# EasyEDA Pro project power supply.epro

# Schematic Schematic1
Board Name: Board1; Create Date: 2026-01-18; Page Name: P1; Project Name: Power_Supply_Board; Schematic Name: Schematic1; Update Date: 2026-02-10; Company: EasyEDA.com; Page Size: A4; Version: V1.0
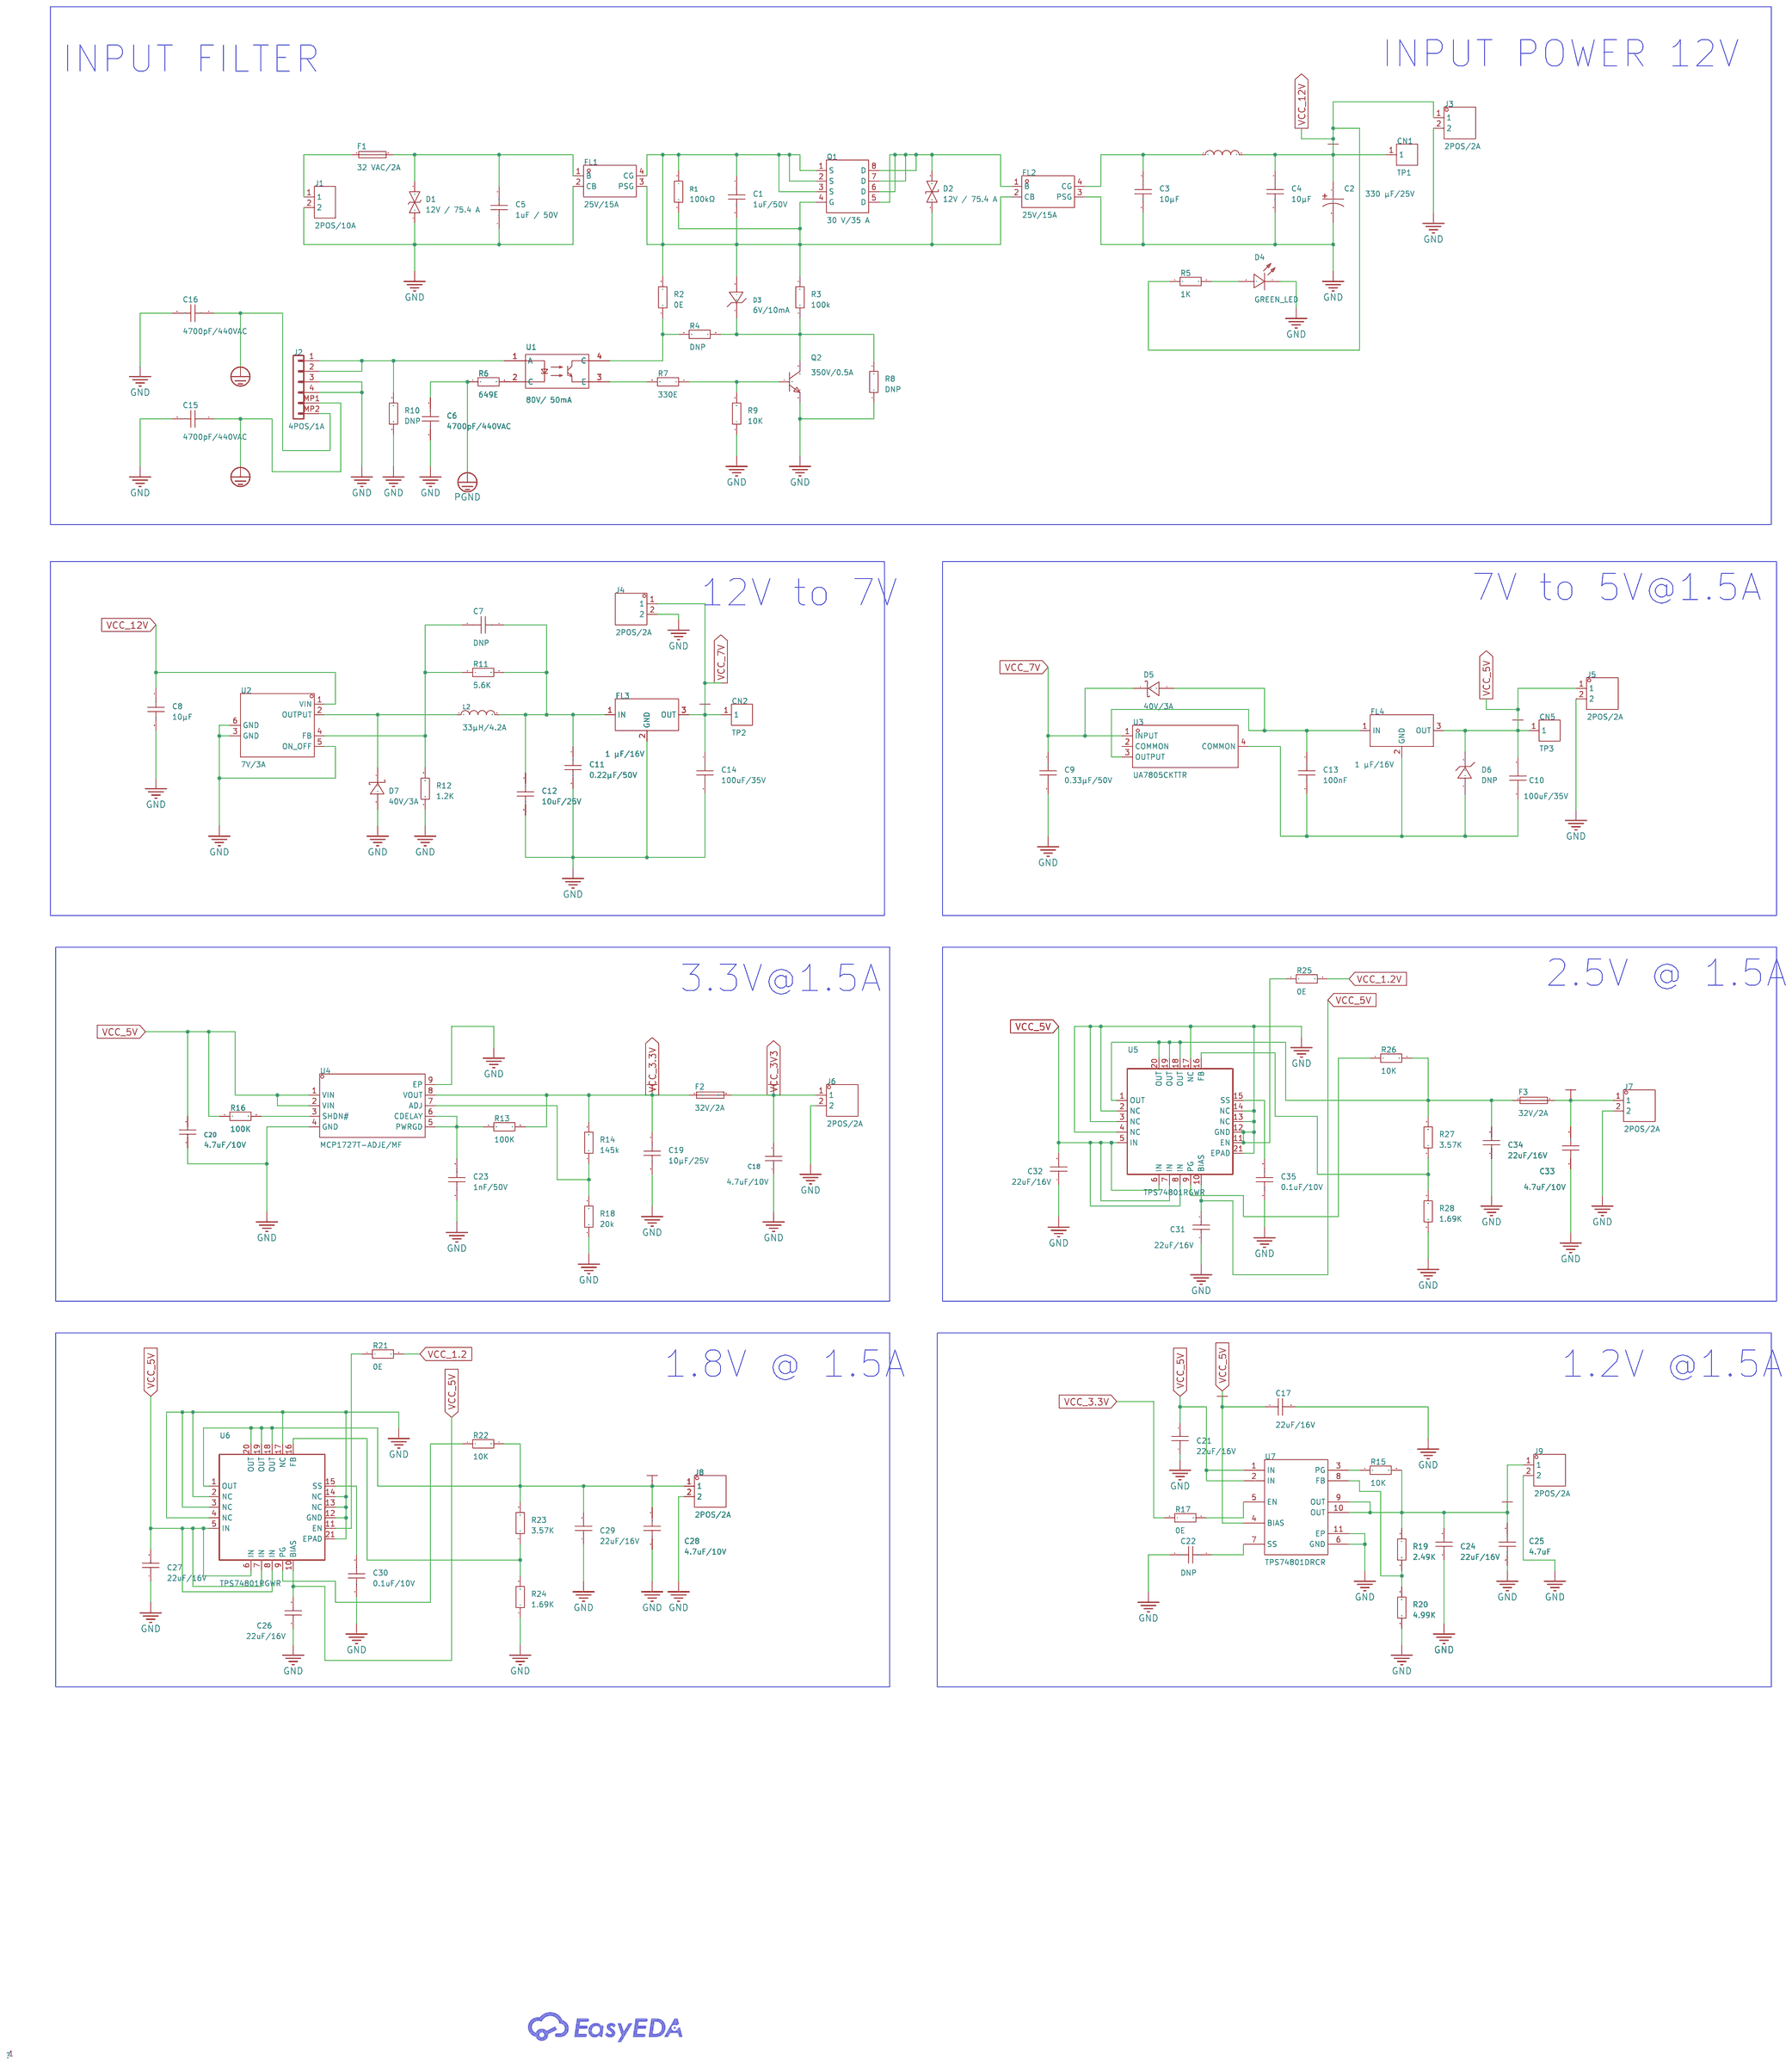
[diagram p0: schematic sheet]

## Parts
C1  1uF/50V  [C0603]
C2  330 µF/25V  [CAP-SMD_BD10.0-L10.3-W10.3-FD]
C3  10µF  [C0603]
C4  10µF  [C0603]
C5  1uF / 50V  [C0402]
C6  4700pF/440VAC  [CAP-TH_L11.0-W5.0-P10.00-D0.7]
C7  DNP  [C0603]
C8  10µF  [C0603]
C9  0.33µF/50V  [C0603]
C10  100uF/35V  [C0603]
C11  0.22µF/50V  [C0603]
C12  10uF/25V  [C0603]
C13  100nF  [C0603]
C14  100uF/35V  [C0603]
C15  4700pF/440VAC  [C0603]
C16  4700pF/440VAC  [C0603]
C17  22uF/16V  [C0805]
C18  4.7uF/10V  [C0603]
C19  10µF/25V  [C0603]
C20  4.7uF/10V  [C0603]
C21  22uF/16V  [C0805]
C22  DNP  [C0402]
C23  1nF/50V  [C0402]
C24  22uF/16V  [C0805]
C25  4.7uF  [C0603]
C26  22uF/16V  [C0805]
C27  22uF/16V  [C0805]
C28  4.7uF/10V  [C0603]
C29  22uF/16V  [C0805]
C30  0.1uF/10V  [C0402]
C31  22uF/16V  [C0805]
C32  22uF/16V  [C0805]
C33  4.7uF/10V  [C0603]
C34  22uF/16V  [C0805]
C35  0.1uF/10V  [C0402]
CN1  TP1  [CONN-SMD_5017]
CN2  TP2  [CONN-SMD_5017]
CN5  TP3  [CONN-SMD_5017]
D1  12V / 75.4 A  [D0402-BI]
D2  12V / 75.4 A  [SMC_L6.9-W5.9-LS7.9-BI]
D3  6V/10mA  [SOD-123_L2.7-W1.6-LS3.7-RD]
D4  GREEN_LED  [LED0603-RD]
D5  40V/3A  [SOD-128_L3.7-W2.5-LS4.7-RD]
D6  DNP  [SOD-123_L2.8-W1.8-LS3.7-RD]
D7  40V/3A  [SOD-128_L3.7-W2.5-LS4.7-RD]
F1  32 VAC/2A  [FUSE-SMD_L20.0-W5.2]
F2  32V/2A  [F0402]
F3  32V/2A  [F0402]
FL1  25V/15A  [FILTER-TH_6P-L12.0-W11.0_BNX016-01]
FL2  25V/15A  [FILTER-TH_6P-L12.0-W11.0_BNX016-01]
FL3  1 µF/16V  [FILTER-SMD_3P-L2.0-W1.2-L]
FL4  1 µF/16V  [FILTER-SMD_3P-L2.0-W1.2-L]
J1  2POS/10A  [CONN-TH_2P-P3.96-V]
J2  Molex_PicoBlade_1x4_0533980471  [antmicro-footprints:Conn_Molex_PicoBlade_1x4_0533980471]
J3  2POS/2A  [CONN-TH_S2B-PH-K-S-GW]
J4  2POS/2A  [CONN-TH_S2B-PH-K-S-GW]
J5  2POS/2A  [CONN-TH_S2B-PH-K-S-GW]
J6  2POS/2A  [CONN-TH_S2B-PH-K-S-GW]
J7  2POS/2A  [CONN-TH_S2B-PH-K-S-GW]
J8  2POS/2A  [CONN-TH_S2B-PH-K-S-GW]
J9  2POS/2A  [CONN-TH_S2B-PH-K-S-GW]
L1  22uH  [7447709220]
L2  33µH/4.2A  [IND-SMD_L12.0-W12.0-A]
Q1  30 V/35 A  [POWERPAK-1212-8_L3.0-W3.0-P0.65-LS3.3-BL]
Q2  350V/0.5A  [SOT-23-3_L2.9-W1.3-P1.90-LS2.4-BR]
R1  100kΩ  [R0603]
R2  0E  [R0603]
R3  100k  [R0603]
R4  DNP  [R0603]
R5  1K  [R0603]
R6  649E  [R0603]
R7  330E  [R0603]
R8  DNP  [R0603]
R9  10K  [R0603]
R10  DNP  [R0603]
R11  5.6K  [R0603]
R12  1.2K  [R0603]
R13  100K  [R0402]
R14  145k  [R0603]
R15  10K  [R0603]
R16  100K  [R0402]
R17  0E  [R0603]
R18  20k  [R0603]
R19  2.49K  [R0603]
R20  4.99K  [R0603]
R21  0E  [R0603]
R22  10K  [R0603]
R23  3.57K  [R0603]
R24  1.69K  [R0603]
R25  0E  [R0603]
R26  10K  [R0603]
R27  3.57K  [R0603]
R28  1.69K  [R0603]
U1  80V/ 50mA  [SOP-4_L6.5-W4.6-P2.54-LS10.3-TL]
U2  7V/3A  [TO-263-5_L10.4-W8.6-P1.70-LS15.3-BR]
U3  UA7805CKTTR  [TO-263-3_L10.2-W9.0-P2.54-LS15.2-TL]
U4  MCP1727T-ADJE/MF  [DFN-8_L3.0-W3.0-P0.65-BL-EP]
U5  TPS74801RGWR  [VQFN-20_L5.0-W5.0-P0.65-TL-EP]
U6  TPS74801RGWR  [VQFN-20_L5.0-W5.0-P0.65-TL-EP]
U7  TPS74801DRCR  [VSON-10_L3.0-W3.0-P0.50-TL-EP]

## Library data of the parts
C1 C3 C4 C7-C16 C19 C25 C28 C33 = CAP_0603: Supplier Footprint: 0603
C2 = EEHZA1E331P: Capacitance:330uF Tolerance:±20% Tolerance:±20% Voltage Rating:25V Ripple Current:375mA@100Hz Equivalent Series Resistance(ESR):20mΩ Lifetime:10000hrs@105℃ Operating Temperature:-55℃~+105℃ Operating Temperature:-55℃~+105℃ Pin Spacing:- Diameter:10mm Heigh; LCSC Part Name: 330uF ±20% 25V; Supplier Part: C236302; Manufacturer: PANASONIC(松下); Supplier Footprint: SMD,D10xL10.2mm; JLCPCB Part Class: Extended Part; Datasheet: https://item.szlcsc.com/datasheet/EEHZA1E331P/235924.html; Supplier: LCSC; Tolerance: ±20%; Voltage Rating: 25V; Ripple Current: 375mA@100Hz; Equivalent Series Resistance(ESR): 20mΩ; Lifetime: 10000hrs@105℃; Operating Temperature: -55℃~+105℃; Diameter: 10mm; Height - Seated (Max): 10.2mm
C5 = CL05B104KO5NNNC: Capacitance:100nF Tolerance:±10% Tolerance:±10% Voltage Rating:16V Temperature Coefficient:X7R; LCSC Part Name: 100nF ±10% 16V; Supplier Part: C1525; Manufacturer: SAMSUNG(三星); Supplier Footprint: 0402; JLCPCB Part Class: Basic Part; Datasheet: https://item.szlcsc.com/datasheet/CL05B104KO5NNNC/1877.html; Supplier: LCSC; Tolerance: ±10%; Voltage Rating: 16V; Temperature Coefficient: X7R
C6 = C947U472MZVDBA7317: Capacitance:4.7nF Tolerance:±20% Tolerance:±20% Voltage(AC):440V Ratings:X1,Y2 Operating Temperature:-40℃~+125℃ Operating Temperature:-40℃~+125℃; LCSC Part Name: 等级:X1,Y2 4.7nF ±20% 440V; Supplier Part: C1623429; Manufacturer: KEMET(基美); Supplier Footprint: 插件,P=7.5mm; JLCPCB Part Class: Extended Part; Datasheet: https://item.szlcsc.com/datasheet/C947U472MZVDBA7317/1714275.html; Supplier: LCSC; Tolerance: ±20%; Voltage(AC): 440V; Ratings: X1,Y2; Operating Temperature: -40℃~+125℃
C17 C21 C24 C26 C27 C29 C31 C32 C34 = CL21A226MOQNNNE: 容值:22uF;精度:±20%;额定电压:16V;材质(温度系数):X5R;; LCSC Part Name: 22uF ±20% 16V; Supplier Part: C98190; Manufacturer: SAMSUNG(三星); Supplier Footprint: 0805; JLCPCB Part Class: Extended Part; Datasheet: https://atta.szlcsc.com/upload/public/pdf/source/20170412/1491969143888.pdf; Supplier: LCSC; Tolerance: ±20%; Voltage Rated: 16V; Temperature Coefficient: X5R
C18 C20 = CL10A475KP8NNNC: Capacitance:4.7uF Tolerance:±10% Tolerance:±10% Voltage Rating:10V Temperature Coefficient:X5R; LCSC Part Name: 4.7uF ±10% 10V; Supplier Part: C1705; Manufacturer: SAMSUNG(三星); Supplier Footprint: 0603; JLCPCB Part Class: Extended Part; Datasheet: https://item.szlcsc.com/datasheet/CL10A475KP8NNNC/2057.html; Supplier: LCSC; Tolerance: ±10%; Voltage Rating: 10V; Temperature Coefficient: X5R
C22 C30 C35 = CC0402JRX7R6BB104: Capacitance: Tolerance:±5% Tolerance:±5% Voltage Rated: Temperature Coefficient:; LCSC Part Name: 100nF ±5% 10V; Supplier Part: C527001; Manufacturer: YAGEO(国巨); Supplier Footprint: 0402; JLCPCB Part Class: Extended Part; Datasheet: https://atta.szlcsc.com/upload/public/pdf/source/20200508/C527001_BBD65F146D934E2FFF77EAA00FC82E63.pdf; Supplier: LCSC; Tolerance: ±5%
C23 = GRM1555C1H102JA01D: Capacitance:1nF Tolerance:±5% Tolerance:±5% Voltage Rating:50V Temperature Coefficient:C0G; LCSC Part Name: 1nF ±5% 50V; Supplier Part: C76947; Manufacturer: muRata(村田); Supplier Footprint: 0402; JLCPCB Part Class: Extended Part; Datasheet: https://item.szlcsc.com/datasheet/GRM1555C1H102JA01D/78074.html; Supplier: LCSC; Tolerance: ±5%; Voltage Rating: 50V; Temperature Coefficient: C0G
CN1 CN2 CN5 = 5017: Supplier Part: C9900015874; Supplier Footprint: Testpoint_SMD; JLCPCB Part Class: Extended Part; Supplier: LCSC
D1 = GSEPD15B0005: Supplier Part: C19841114; Manufacturer: GOOD-ARK(固锝); Supplier Footprint: 0402; JLCPCB Part Class: Extended Part; Datasheet: https://atta.szlcsc.com/upload/public/pdf/source/20240122/F55FF7028080527729AF26468FA4F1C4.pdf; Supplier: LCSC
D2 = SMCJ12CA_C41411748: Polarity:Bidirectional Reverse Stand-Off Voltage (Vrwm):12V Clamping Voltage:19.9V Peak Pulse Current (Ipp):75.4A Peak Pulse Power Dissipation (Ppp):1.5kW Voltage - Breakdown:14.7V Reverse Leakage Current (Ir):1uA Number of Channels:2 Operating Temperatur; LCSC Part Name: 双向TVS 12V截止 峰值浪涌电流：75.4A; Supplier Part: C41411748; Manufacturer: R+O(宏嘉诚); Supplier Footprint: SMC(DO-214AB); JLCPCB Part Class: Extended Part; Datasheet: https://item.szlcsc.com/datasheet/SMCJ12CA/43223691.html; Supplier: LCSC; Polarity: Bidirectional; Reverse Stand-Off Voltage (Vrwm): 12V; Clamping Voltage: 19.9V; Peak Pulse Current (Ipp): 75.4A; Peak Pulse Power Dissipation (Ppp): 1.5kW; Voltage - Breakdown: 14.7V; Reverse Leakage Current (Ir): 1uA; Number of Channels: 2; Operating Temperature: -55℃~+150℃; level of protection: IEC 61000-4-2; Type: TVS
D3 = MMSZ5233BT1G: Diode Configuration:Independent Zener Voltage(Nom):6V Reverse Leakage Current (Ir):5uA@3.5V Zener Voltage(Range):5.7V~6.3V Zener Voltage(Range):5.7V~6.3V Pd - Power Dissipation:500mW Impedance(Zzt):7Ω Impedance(Zzk):1.6kΩ Operating Junction Temperature Ra; Supplier Part: C145506; Manufacturer: onsemi(安森美); Supplier Footprint: SOD-123; JLCPCB Part Class: Extended Part; Datasheet: https://item.szlcsc.com/datasheet/MMSZ5233BT1G/156838.html; Supplier: LCSC; Diode Configuration: Independent; Zener Voltage(Nom): 6V; Reverse Leakage Current (Ir): 5uA@3.5V; Zener Voltage(Range): 5.7V~6.3V; Pd - Power Dissipation: 500mW; Impedance(Zzt): 7Ω; Impedance(Zzk): 1.6kΩ; Operating Junction Temperature Range: -55℃~+150℃
D4 = LTST-C190KGKT: Emitted Color:Green-yellow Forward Voltage (VF):2V Forward Voltage (VF):2V Power Dissipation:75mW Forward Current:20mA Dominant Wavelength:567.5nm~576.5nm Dominant Wavelength:567.5nm~576.5nm Peak Wavelength:574nm Diode Configuration:- Lens Color:无色透明透镜 Co; LCSC Part Name: 普绿/黄绿; Supplier Part: C125094; Manufacturer: LITEON(光宝); Supplier Footprint: 0603; JLCPCB Part Class: Extended Part; Datasheet: https://atta.szlcsc.com/upload/public/pdf/source/20180129/C125094_15171883203831315957.pdf; Supplier: LCSC; Emitted Color: Green-yellow; Forward Voltage (VF): 2V; Power Dissipation: 75mW; Forward Current: 20mA; Dominant Wavelength: 567.5nm~576.5nm; Peak Wavelength: 574nm; Lens Color: 无色透明透镜; Luminous Intensity: 35mcd; Viewing Angle: 130°; Operating Temperature: -30℃~+85℃
D5 D7 = PMEG40T30EPX: Voltage - Forward(Vf@If):525mV@3A Voltage - DC Reverse(Vr):40V Current - Rectified:3A Reverse Leakage Current (Ir):28uA@40V; LCSC Part Name: 电压:40V 电流:3A; Supplier Part: C552919; Manufacturer: Nexperia(安世); Supplier Footprint: SOD-128; JLCPCB Part Class: Extended Part; Datasheet: https://item.szlcsc.com/datasheet/PMEG40T30EPX/573916.html; Supplier: LCSC; Voltage - Forward(Vf@If): 525mV@3A; Voltage - DC Reverse(Vr): 40V; Current - Rectified: 3A; Reverse Leakage Current (Ir): 28uA@40V
D6 = MMSZ5231B-7-F: Diode Configuration:Independent Zener Voltage(Nom):5.1V Reverse Leakage Current (Ir):5uA@2.0V Zener Voltage(Range):4.85V~5.36V Zener Voltage(Range):4.85V~5.36V Pd - Power Dissipation:370mW Impedance(Zzt):17Ω Impedance(Zzk):1.6kΩ Operating Junction Tempera; LCSC Part Name: 独立式 耐压:5.1V 电流:5uA@2.0V; Supplier Part: C85181; Manufacturer: DIODES(美台); Supplier Footprint: SOD-123; JLCPCB Part Class: Extended Part; Datasheet: https://item.szlcsc.com/datasheet/MMSZ5231B-7-F/86353.html; Supplier: LCSC; Diode Configuration: Independent; Zener Voltage(Nom): 5.1V; Reverse Leakage Current (Ir): 5uA@2.0V; Zener Voltage(Range): 4.85V~5.36V; Pd - Power Dissipation: 370mW; Impedance(Zzt): 17Ω; Impedance(Zzk): 1.6kΩ; Operating Junction Temperature Range: -65℃~+150℃
F1 = Fuse SGT520-8A: Type:Glass Tube Fuse Current Rating:8A Voltage Rating (AC):250V Voltage Rating (DC):250V Operating Temperature:-55℃~+125℃ Operating Temperature:-55℃~+125℃ Melting I2t:166 Interrupt Rating:8A@250VAC Diameter (φD):5.2mm Length:20mm; LCSC Part Name: 8A 250VAC 慢断; Supplier Part: C2997196; Manufacturer: SET(赛尔特); Supplier Footprint: D5.2xL20mm; JLCPCB Part Class: Extended Part; Datasheet: https://item.szlcsc.com/datasheet/Fuse%2520SGT520-8A/3466294.html; Supplier: LCSC; Type: Glass Tube Fuse; Current Rating: 8A; Voltage Rating (AC): 250V; Voltage Rating (DC): 250V; Operating Temperature: -55℃~+125℃; Melting I2t: 166; Interrupt Rating: 8A@250VAC; Diameter (φD): 5.2mm; Length: 20mm
F2 F3 = ERBRD2R00X: Type:Surface Mount Fuse Current Rating:2A Voltage Rating (DC):32V Operating Temperature:-40℃~+125℃ Operating Temperature:-40℃~+125℃ Interrupt Rating:35A Length:1mm Width:0.5mm Height:0.39mm; LCSC Part Name: 贴片式保险丝; Supplier Part: C424348; Manufacturer: PANASONIC(松下); Supplier Footprint: 0402; JLCPCB Part Class: Extended Part; Datasheet: https://item.szlcsc.com/datasheet/ERBRD2R00X/417761.html; Supplier: LCSC; Type: Surface Mount Fuse; Current Rating: 2A; Voltage Rating (DC): 32V; Operating Temperature: -40℃~+125℃; Interrupt Rating: 35A; Length: 1mm; Width: 0.5mm; Height: 0.39mm
FL1 FL2 = BNX016-01: Voltage Rating:25V Current Rating:15A Frequency - Cutoff or Center:- Frequency - Cutoff or Center:- Inductance:- Filter Order:5 Resistance:- Capacitance:- ESD Protection:Yes Number of Channels:2 Attenuation Value:40dB@100kHz~1GHz Operating Temperature:-40; LCSC Part Name: 两路5阶 具有ESD保护的EMI滤波器; Supplier Part: C393167; Manufacturer: muRata(村田); Supplier Footprint: 插件; JLCPCB Part Class: Extended Part; Datasheet: https://item.szlcsc.com/datasheet/BNX016-01/370693.html; Supplier: LCSC; Voltage Rating: 25V; Current Rating: 15A; Filter Order: 5; ESD Protection: Yes; Number of Channels: 2; Attenuation Value: 40dB@100kHz~1GHz; Operating Temperature: -40℃~+125℃
FL3 FL4 = NFM21PC105B1C3D: Nominal Capacitance:1uF Tolerance:±20% Tolerance:±20% Voltage Rating:16V Current Rating:4A DC Resistance(DCR):20mΩ Operating Temperature:-40℃~+85℃ Operating Temperature:-40℃~+85℃; LCSC Part Name: 1.0uF(105) ±20%16V; Supplier Part: C92518; Manufacturer: muRata(村田); Supplier Footprint: SMD-4P,2x1.2mm; JLCPCB Part Class: Extended Part; Datasheet: https://item.szlcsc.com/datasheet/NFM21PC105B1C3D/93711.html; Supplier: LCSC; Nominal Capacitance: 1uF; Tolerance: ±20%; Voltage Rating: 16V; Current Rating: 4A; DC Resistance(DCR): 20mΩ; Operating Temperature: -40℃~+85℃
J1 = B2P-VH-GZ: Pins Structure:1x2P Pitch:3.96mm Mounting Type:Through Hole Reference Series:VH Number of Pins:2P Number of Rows:1 Number of PINs Per Row:2 Row Spacing:- Current Rating:10A Contact Material:Brass Contact Plating:Gold Operating Temperature:-25℃~+85℃ Operat; LCSC Part Name: 1x2P 间距:3.96mm 直插 系列:VH; Supplier Part: C17525990; Manufacturer: JST; Supplier Footprint: 插件,P=3.96mm; JLCPCB Part Class: Extended Part; Datasheet: https://item.szlcsc.com/datasheet/B2P-VH-GZ/18655202.html; Supplier: LCSC; Pins Structure: 1x2P; Pitch: 3.96mm; Mounting Type: Through Hole; Reference Series: VH; Number of Pins: 2P; Number of Rows: 1; Number of PINs Per Row: 2; Current Rating: 10A; Contact Material: Brass; Contact Plating: Gold; Operating Temperature: -25℃~+85℃; Voltage Rating: 250V; Plastic Material: PA66; Flame Retardant Rating: UL94V-0; Color: White; Z-Height of the Board: 9.4mm; X-Length of Bottom Edge on Board (Spacing Line): 7.86mm; Y-Width of Bottom Edge on Board: 8.5mm
J2 = antmicroWire2BoardConnectors_Molex_PicoBlade_1x4_0533980471: Users: License: Apache-2.0; datasheet: https://www.molex.com/molex/products/part-detail/pcb_headers/0533980471; author: Antmicro; license: Apache-2.0; mpn: 0533980471; manufacturer: Molex; User doc link: https://www.molex.com/molex/products/part-detail/pcb_headers/0533980471
J3-J9 = S2B-PH-K-S-GW: Pins Structure:1x2P Pitch:2mm Mounting Type:Right Angle Reference Series:PH Number of Pins:2P Number of Rows:1 Number of PINs Per Row:2 Row Spacing:- Current Rating:2A Contact Material:Brass Contact Plating:Tin Operating Temperature:-25℃~+85℃ Operating Te; LCSC Part Name: 1x2P 间距:2mm 弯插 系列:PH; Supplier Part: C157932; Manufacturer: JST; Supplier Footprint: 弯插,P=2mm; JLCPCB Part Class: Extended Part; Datasheet: https://item.szlcsc.com/datasheet/S2B-PH-K-S-GW/169280.html; Supplier: LCSC; Pins Structure: 1x2P; Pitch: 2mm; Mounting Type: Right Angle; Reference Series: PH; Number of Pins: 2P; Number of Rows: 1; Number of PINs Per Row: 2; Current Rating: 2A; Contact Material: Brass; Contact Plating: Tin; Operating Temperature: -25℃~+85℃; Voltage Rating: 100V; Plastic Material: PA66; Flame Retardant Rating: UL94V-0; Supplementary Features: K Pin; Color: White; Z-Height of the Board: 4.8mm; X-Length of Bottom Edge on Board (Spacing Line): 5.9mm; Y-Width of Bottom Edge on Board: 7.6mm
L1 = 7447709220: Manufacturer Part: 22µH/5.3A; Manufacturer: WURTH
L2 = 7447709330: Inductance: Tolerance:±20% Tolerance:±20% Rated Current: Saturation Current (Isat):5.5A DC Resistance (DCR): Type:- Ratings:AEC-Q200; LCSC Part Name: 33uH ±20% 5.5A; Supplier Part: C2651182; Manufacturer: Wurth(伍尔特); Supplier Footprint: 1210; JLCPCB Part Class: Extended Part; Datasheet: https://atta.szlcsc.com/upload/public/pdf/source/20210414/76E7EC767D1F74C2F12BC88CD3718373.pdf; Supplier: LCSC; Tolerance: ±20%; Saturation Current (Isat): 5.5A; Ratings: AEC-Q200
Q1 = MSISH101DN-T1-GE3: Supplier Part: C51908760; Manufacturer: MSKSEMI(美森科); Supplier Footprint: DFN-8L(3x3); JLCPCB Part Class: Extended Part; Datasheet: https://item.szlcsc.com/datasheet/MSISH101DN-T1-GE3/54606248.html; Supplier: LCSC
Q2 = FMMT6517TA: type:NPN Current - Collector(Ic):500mA Collector - Emitter Voltage VCEO:350V Pd - Power Dissipation:350mW DC Current Gain:15@100mA,10V DC Current Gain:15@100mA,10V Transition frequency(fT):50MHz Current - Collector Cutoff:50nA Vce Saturation(VCE(sat)):1V@; LCSC Part Name: NPN 电流:500mA 电压:350V; Supplier Part: C155518; Manufacturer: DIODES(美台); Supplier Footprint: SOT-23; JLCPCB Part Class: Extended Part; Datasheet: https://item.szlcsc.com/datasheet/FMMT6517TA/166860.html; Supplier: LCSC; type: NPN; Current - Collector(Ic): 500mA; Collector - Emitter Voltage VCEO: 350V; Pd - Power Dissipation: 350mW; DC Current Gain: 15@100mA,10V; Transition frequency(fT): 50MHz; Current - Collector Cutoff: 50nA; Vce Saturation(VCE(sat)): 1V@50mA,5mA; Operating Temperature: -55℃~+150℃; Emitter-Base Voltage(Vebo): 7V
R1 = RC0603FR-07100KL: Type:Thick Film Resistors Resistance: Tolerance:±1% Tolerance:±1% Power(Watts): Overload Voltage (Max): Temperature Coefficient:±100ppm/℃ Temperature Coefficient:±100ppm/℃ Operating Temperature Range:-55℃~+155℃ Operating Temperature Range:-55℃~+155℃; LCSC Part Name: 厚膜电阻 100kΩ ±1% 100mW; Supplier Part: C14675; Manufacturer: YAGEO(国巨); Supplier Footprint: 0603; JLCPCB Part Class: Extended Part; Datasheet: https://atta.szlcsc.com/upload/public/pdf/source/20140324/1457707028752.pdf; Supplier: LCSC; Type: Thick Film Resistors; Tolerance: ±1%; Temperature Coefficient: ±100ppm/℃; Operating Temperature Range: -55℃~+155℃
R2-R12 R14 R15 R17-R28 = Res_0603: Supplier Footprint: 0603
R13 R16 = ERJ2RKF1003X: Type:Thick Film Resistors Resistance:100kΩ Tolerance:±1% Tolerance:±1% Power(Watts): Overload Voltage (Max):- Temperature Coefficient:±100ppm/℃ Temperature Coefficient:±100ppm/℃ Operating Temperature Range:-55℃~+155℃ Operating Temperature Range:-55℃~+155℃; LCSC Part Name: 100kΩ ±1% 100mW 厚膜电阻; Supplier Part: C192169; Manufacturer: PANASONIC(松下); Supplier Footprint: 0402; JLCPCB Part Class: Extended Part; Datasheet: https://atta.szlcsc.com/upload/public/pdf/source/20180621/C194072_A7E4037DF0016B74406F0B5B438DC1E1.pdf; Supplier: LCSC; Type: Thick Film Resistors; Tolerance: ±1%; Temperature Coefficient: ±100ppm/℃; Operating Temperature Range: -55℃~+155℃
U1 = VO617A-8X017T: Forward Voltage:1.35V Output Current:50mA Isolation Voltage(rms):5.3kV Number of Outputs:1 Rise time:2us Fall time:2us Operating Temperature:-55℃~+110℃ Operating Temperature:-55℃~+110℃; Supplier Part: C17653063; Manufacturer: VISHAY(威世); Supplier Footprint: SMD-4P; JLCPCB Part Class: Extended Part; Datasheet: https://atta.szlcsc.com/upload/public/pdf/source/231023/C17252083-247b27188f6e36515790b70740c37c97.pdf; Supplier: LCSC; Forward Voltage: 1.35V; Output Current: 50mA; Isolation Voltage(rms): 5.3kV; Number of Outputs: 1; Rise time: 2us; Fall time: 2us; Operating Temperature: -55℃~+110℃
U2 = LM2596S-ADJ_C3198435: Function:Step-down type Output Type:Adjustable Input Voltage:4.5V~40V Input Voltage:4.5V~40V Output Voltage:1.2V~37V Output Voltage:1.2V~37V Output Current:3A Switching Frequency:150kHz Switching Frequency:150kHz Operating Temperature:-40℃~+125℃@(TJ) Oper; LCSC Part Name: LM2596S-ADJ; Supplier Part: C3198435; Supplier Footprint: TO-263-5; Datasheet: https://atta.szlcsc.com/upload/public/pdf/source/20230921/2B96ED50C3BF1924A72365F91F431302.pdf; Supplier: LCSC; Function: Step-down type; Output Type: Adjustable; Input Voltage: 4.5V~40V; Output Voltage: 1.2V~37V; Output Current: 3A; Switching Frequency: 150kHz; Operating Temperature: -40℃~+125℃@(TJ); Synchronous Rectification: No; Number of Outputs: 1; Topology: Step-down; Switch tube (built-in/external): Built-in
U3 = UA7805CKTTR: Output Type:Fixed Voltage - Supply:25V Output Voltage:5V Output Voltage:5V Output Current:1.5A Power Supply Rejection Ratio (PSRR):78dB@(120Hz) Voltage Dropout:2V@(1A) standby current:4.2mA Noise:40uV Features:Short Circuit Protection；Over Temperature Pro; LCSC Part Name: 5V 1.5A 25V; Supplier Part: C962135; Manufacturer: TI(德州仪器); Supplier Footprint: TO-263-3; JLCPCB Part Class: Extended Part; Datasheet: https://www.ti.com/cn/lit/gpn/ua78; Supplier: LCSC; Output Type: Fixed; Voltage - Supply: 25V; Output Voltage: 5V; Output Current: 1.5A; Power Supply Rejection Ratio (PSRR): 78dB@(120Hz); Voltage Dropout: 2V@(1A); standby current: 4.2mA; Noise: 40uV; Features: Short Circuit Protection；Over Temperature Protection；Over Current Protection；Over Voltage Protection; Operating Temperature: 0℃~+125℃@(Ta); Output Configuration: Positive; Number of Outputs: 1
U4 = MCP1727T-ADJE/MF: Output Type:Adjustable Voltage - Supply:6V Output Voltage:800mV~5V Output Voltage:800mV~5V Output Current:1.5A Power Supply Rejection Ratio (PSRR):60dB@(100Hz) Voltage Dropout:330mV@(1.5A) standby current:120uA Noise:- Features:Enable；Under Voltage Lockou; LCSC Part Name: 800mV~5V 1.5A 6V; Supplier Part: C111281; Manufacturer: MICROCHIP(美国微芯); Supplier Footprint: DFN-8-EP(3x3); JLCPCB Part Class: Extended Part; Datasheet: https://item.szlcsc.com/datasheet/MCP1727T-ADJE%252FMF/112507.html; Supplier: LCSC; Output Type: Adjustable; Voltage - Supply: 6V; Output Voltage: 800mV~5V; Output Current: 1.5A; Power Supply Rejection Ratio (PSRR): 60dB@(100Hz); Voltage Dropout: 330mV@(1.5A); standby current: 120uA; Features: Enable；Under Voltage Lockout；Over Temperature Protection；Over Current Protection；Short Circuit Protection; Operating Temperature: -40℃~+125℃@(Tj); Output Configuration: Positive; Number of Outputs: 1
U5 U6 = TPS74801RGWR: Supplier: LCSC; Supplier Part: C129193; Manufacturer: Texas Instruments; JLCPCB Part Class: Extended Part
U7 = TPS74801DRCR: Output Type:Adjustable Voltage - Supply:5.5V Output Voltage:800mV~3.6V Output Voltage:800mV~3.6V Output Current:1.5A Power Supply Rejection Ratio (PSRR):60dB Voltage Dropout:60mV@(1.5A) standby current:- Noise:- Features:Enable；Over Temperature Protection; LCSC Part Name: 800mV~3.6V 1.5A 5.5V; Supplier Part: C105263; Manufacturer: TI(德州仪器); Supplier Footprint: VSON-10-EP(3x3); JLCPCB Part Class: Extended Part; Datasheet: https://www.ti.com/cn/lit/gpn/tps74801; Supplier: LCSC; Output Type: Adjustable; Voltage - Supply: 5.5V; Output Voltage: 800mV~3.6V; Output Current: 1.5A; Power Supply Rejection Ratio (PSRR): 60dB; Voltage Dropout: 60mV@(1.5A); Features: Enable；Over Temperature Protection；Over Current Protection；Under Voltage Lockout; Operating Temperature: -40℃~+125℃@(Tj); Output Configuration: Positive; Number of Outputs: 1

## Nets
GND: C2.2 C3.2 C4.2 C5.1 C6.1 C8.2 C9.2 C11.2 C12.2 C14.2 C15.2 C16.2 C17.2 C18.1 C19.2 C20.1 C21.1 C22.1 C23.1 C24.1 C25.2 C26.1 C27.1 C28.2 C29.1 C30.1 C31.1 C32.1 C33.2 C34.1 C35.1 D1.1 D4.1(-) D7.2(A) FL1.2(CB) FL2.3(PSG) FL3.2(GND) J1.2 J2.3 J2.4 J3.2 J4.2 J5.2 J6.2 J7.2 J8.2 J9.2 Q2.2(E) R8.1 R9.1 R10.1 R12.1 R18.1 R20.1 R24.1 R25.1 R28.1 U2.3(GND) U2.5(ON_OFF) U2.6(GND) U4.4(GND) U4.9(EP) U5.2(NC) U5.3(NC) U5.4(NC) U5.11(EN) U5.12(GND) U5.13(NC) U5.14(NC) U5.17(NC) U5.21(EPAD) U6.2(NC) U6.3(NC) U6.4(NC) U6.12(GND) U6.13(NC) U6.14(NC) U6.17(NC) U6.21(EPAD) U7.6(GND) U7.11(EP)
PGND: C6.2 R6.1
VCC_1.2: R21.2
VCC_1.2V: C24.2 C25.1 J9.1 R15.2 R19.2 R25.2 U7.9(OUT) U7.10(OUT)
VCC_1.8V: C28.1 C29.2 J8.1 R22.2 R23.2 U6.1(OUT) U6.18(OUT) U6.19(OUT) U6.20(OUT)
VCC_2.5V: C33.1 F3.2 J7.1
VCC_3.3V: C19.1 F2.1 R13.2 R14.2 R17.1 U4.8(VOUT)
VCC_3V3: C18.2 F2.2 J6.1
VCC_5V: C10.1 C17.1 C20.2 C21.2 C26.2 C27.2 C31.2 C32.2 CN5.1 D6.1(K) FL4.3(OUT) J5.1 R16.1 U4.1(VIN) U4.2(VIN) U5.5(IN) U5.6(IN) U5.7(IN) U5.8(IN) U5.10(BIAS) U6.5(IN) U6.6(IN) U6.7(IN) U6.8(IN) U6.10(BIAS) U7.1(IN) U7.2(IN) U7.4(BIAS)
VCC_7V: C9.1 C14.1 CN2.1 D5.1(C) FL3.3(OUT) J4.1 U3.1(INPUT)
VCC_12V: C2.1 C4.1 C8.1 CN1.1 J3.1 L1.2 R5.1 U2.1(VIN)
ISO_GND: C15.1 C16.1 J2.MP1 J2.MP2
Net-(C1-1): C1.1 C1.2 D2.1 D3.2(A) FL1.3(PSG) FL1.4(CG) FL2.2(CB) Q1.1(S) Q1.2(S) Q1.3(S) Q1.4(G) R1.1 R1.2 R2.2 R3.2
Net-(C3-1): C3.1 FL2.4(CG) L1.1
Net-(C5-2): C5.2 D1.2 F1.2 FL1.1(B)
Net-(C7-1): C7.1 C11.1 C12.1 FL3.1(IN) L2.2 R11.2
Net-(C7-2): C7.2 R11.1 R12.2 U2.4(FB)
Net-(C10-2): C10.2 C13.2 D6.2(A) FL4.2(GND) U3.4(COMMON)
Net-(C13-1): C13.1 D5.2(A) FL4.1(IN) U3.3(OUTPUT)
Net-(C22-2): C22.2 U7.7(SS)
Net-(C23-2): C23.2 R13.1 U4.5(PWRGD) U4.6(CDELAY)
Net-(C30-2): C30.2 U6.15(SS)
Net-(C34-2): C34.2 F3.1 R26.2 R27.2 U5.1(OUT) U5.18(OUT) U5.19(OUT) U5.20(OUT)
Net-(C35-2): C35.2 U5.15(SS)
Net-(D2-2): D2.2 FL2.1(B) Q1.5(D) Q1.6(D) Q1.7(D) Q1.8(D)
Net-(D3-1): D3.1(C) Q2.3(C) R3.1 R4.2 R8.2
Net-(D4-2): D4.2(+) R5.2
Net-(D7-1): D7.1(C) L2.1 U2.2(OUTPUT)
Net-(F1-1): F1.1 J1.1
Net-(J2-1): J2.1 J2.2 R10.2 U1.1(A)
Net-(Q2-1): Q2.1(B) R7.1 R9.2
Net-(R2-1): R2.1 R4.1 U1.4(C)
Net-(R6-2): R6.2 U1.2(C)
Net-(R7-2): R7.2 U1.3(E)
Net-(R14-1): R14.1 R18.2 U4.7(ADJ)
Net-(R15-1): R15.1 U7.3(PG)
Net-(R16-2): R16.2 U4.3(SHDN#)
Net-(R17-2): R17.2 U7.5(EN)
Net-(R19-1): R19.1 R20.2 U7.8(FB)
Net-(R21-1): R21.1 U6.11(EN)
Net-(R22-1): R22.1 U6.9(PG)
Net-(R23-1): R23.1 R24.2 U6.16(FB)
Net-(R26-1): R26.1 U5.9(PG)
Net-(R27-1): R27.1 R28.2 U5.16(FB)

Not connected (* = marked no-connect by the designer): U3 2(COMMON)

## Notes on the sheet
- INPUT POWER 12V
- INPUT FILTER
- 12V to 7V
- 7V to 5V@1.5A
- 3.3V@1.5A
- 2.5V @ 1.5A
- 1.8V @ 1.5A
- 1.2V @1.5A
